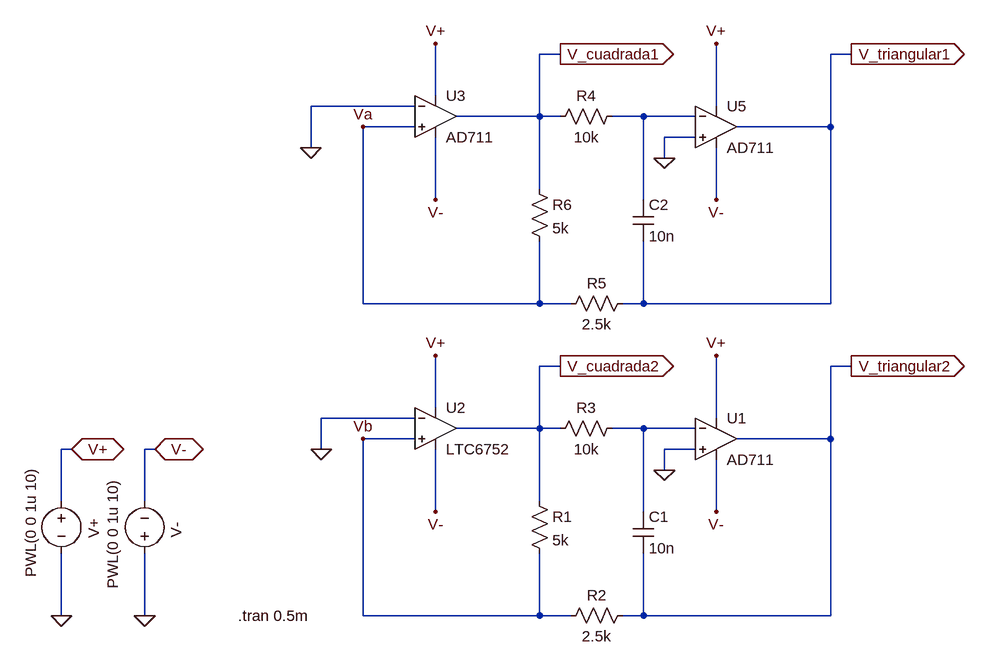
[diagram p0: schematic Ejercicio_2(oscilador_triangular1).asc]
Ejercicio_2(oscilador_triangular1).asc, the LTspice schematic file:
Version 4
SHEET 1 1432 1160
WIRE -144 -352 -176 -352
WIRE 304 -352 272 -352
WIRE -336 -288 -336 -368
WIRE -368 -272 -528 -272
WIRE 96 -272 96 -368
WIRE -176 -256 -176 -352
WIRE -176 -256 -304 -256
WIRE -144 -256 -176 -256
WIRE -16 -256 -64 -256
WIRE 64 -256 -16 -256
WIRE -368 -240 -448 -240
WIRE 272 -240 272 -352
WIRE 272 -240 128 -240
WIRE 64 -224 16 -224
WIRE -528 -208 -528 -272
WIRE 16 -192 16 -224
WIRE -176 -144 -176 -256
WIRE -336 -128 -336 -224
WIRE -16 -128 -16 -256
WIRE 96 -128 96 -208
WIRE -448 32 -448 -240
WIRE -176 32 -176 -64
WIRE -176 32 -448 32
WIRE -128 32 -176 32
WIRE -16 32 -16 -64
WIRE -16 32 -48 32
WIRE 272 32 272 -240
WIRE 272 32 -16 32
WIRE -144 128 -176 128
WIRE 304 128 272 128
WIRE -336 192 -336 112
WIRE -368 208 -512 208
WIRE 96 208 96 112
WIRE -176 224 -176 128
WIRE -176 224 -304 224
WIRE -144 224 -176 224
WIRE -16 224 -64 224
WIRE 64 224 -16 224
WIRE -368 240 -448 240
WIRE 272 240 272 128
WIRE 272 240 128 240
WIRE -896 256 -912 256
WIRE -768 256 -784 256
WIRE -512 256 -512 208
WIRE 64 256 16 256
WIRE 16 288 16 256
WIRE -912 336 -912 256
WIRE -784 336 -784 256
WIRE -176 336 -176 224
WIRE -336 352 -336 256
WIRE -16 352 -16 224
WIRE 96 352 96 272
WIRE -912 512 -912 416
WIRE -784 512 -784 416
WIRE -448 512 -448 240
WIRE -176 512 -176 416
WIRE -176 512 -448 512
WIRE -128 512 -176 512
WIRE -16 512 -16 416
WIRE -16 512 -48 512
WIRE 272 512 272 240
WIRE 272 512 -16 512
FLAG 304 128 V_triangular2
IOPIN 304 128 Out
FLAG 16 288 0
FLAG -912 512 0
FLAG -784 512 0
FLAG -896 256 V+
IOPIN -896 256 BiDir
FLAG -768 256 V-
IOPIN -768 256 BiDir
FLAG -144 128 V_cuadrada2
IOPIN -144 128 Out
FLAG -336 112 V+
FLAG 96 112 V+
FLAG 96 352 V-
FLAG -336 352 V-
FLAG 304 -352 V_triangular1
IOPIN 304 -352 Out
FLAG 16 -192 0
FLAG -528 -208 0
FLAG -144 -352 V_cuadrada1
IOPIN -144 -352 Out
FLAG -336 -368 V+
FLAG 96 -368 V+
FLAG 96 -128 V-
FLAG -336 -128 V-
FLAG -512 256 0
FLAG -448 240 Vb
FLAG -448 -240 Va
SYMBOL voltage -912 320 R0
WINDOW 123 0 0 Left 0
WINDOW 39 0 0 Left 0
WINDOW 0 50 43 VRight 2
WINDOW 3 -47 -36 VRight 2
SYMATTR InstName V+
SYMATTR Value PWL(0 0 1u 10)
SYMBOL voltage -784 432 R180
WINDOW 0 -49 40 VRight 2
WINDOW 3 49 -39 VRight 2
WINDOW 123 0 0 Left 0
WINDOW 39 0 0 Left 0
SYMATTR InstName V-
SYMATTR Value PWL(0 0 1u 10)
SYMBOL res -48 208 R90
WINDOW 0 0 56 VBottom 2
WINDOW 3 32 56 VTop 2
SYMATTR InstName R3
SYMATTR Value 10k
SYMBOL res -32 496 R90
WINDOW 0 0 56 VBottom 2
WINDOW 3 32 56 VTop 2
SYMATTR InstName R2
SYMATTR Value 2.5k
SYMBOL res -192 320 R0
SYMATTR InstName R1
SYMATTR Value 5k
SYMBOL cap -32 352 R0
SYMATTR InstName C1
SYMATTR Value 10n
SYMBOL res -48 -272 R90
WINDOW 0 0 56 VBottom 2
WINDOW 3 32 56 VTop 2
SYMATTR InstName R4
SYMATTR Value 10k
SYMBOL res -32 16 R90
WINDOW 0 0 56 VBottom 2
WINDOW 3 32 56 VTop 2
SYMATTR InstName R5
SYMATTR Value 2.5k
SYMBOL res -192 -160 R0
SYMATTR InstName R6
SYMATTR Value 5k
SYMBOL cap -32 -128 R0
SYMATTR InstName C2
SYMATTR Value 10n
SYMBOL Comparators\\LTC6752 -336 160 R0
SYMATTR InstName U2
SYMBOL OpAmps\\AD711 96 -304 R0
SYMATTR InstName U5
SYMBOL OpAmps\\AD711 96 176 R0
SYMATTR InstName U1
SYMBOL OpAmps\\AD711 -336 -320 R0
SYMATTR InstName U3
TEXT -640 512 Left 2 !.tran 0.5m

The netlist it stands for:
* Ejercicio_2(oscilador_triangular1).asc
V+ V+ 0 PWL(0 0 1u 10)
V- 0 V- PWL(0 0 1u 10)
R3 N002 V_cuadrada2 10k
R2 V_triangular2 Vb 2.5k
R1 V_cuadrada2 Vb 5k
C1 N002 V_triangular2 10n
R4 N001 V_cuadrada1 10k
R5 V_triangular1 Va 2.5k
R6 V_cuadrada1 Va 5k
C2 N001 V_triangular1 10n
XU2 Vb 0 V+ V- V_cuadrada2 LTC6752  ; pins In+ In- V+ V- OUT
XU5 0 N001 V+ V- V_triangular1 AD712  ; AD711, pins In+ In- V+ V- OUT
XU1 0 N002 V+ V- V_triangular2 AD712  ; AD711, pins In+ In- V+ V- OUT
XU3 Va 0 V+ V- V_cuadrada1 AD712  ; AD711, pins In+ In- V+ V- OUT
.tran 0.5m
.lib LTC7.lib
.lib ADI1.lib
.backanno
.end